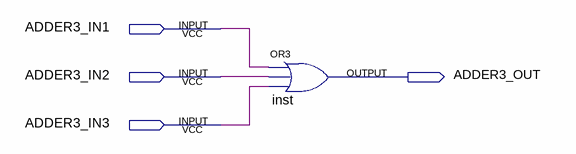
[diagram p0: schematic sheet]
// Quartus schematic ADDER3.bdf as structural Verilog: 1 symbols, 4 pins
module ADDER3 (
  input  ADDER3_IN1,
  input  ADDER3_IN2,
  input  ADDER3_IN3,
  output ADDER3_OUT
);

  or inst (ADDER3_OUT, ADDER3_IN1, ADDER3_IN2, ADDER3_IN3);
endmodule
